# Altium schematic sheet Connectors.SchDoc
size A4; Organization: Rotronic AG; Address1: Grindelstrasse 6; Address2: 8303 Bassersdorf; Address3: Switzerland; SheetNumber: 1; SheetTotal: 1; Web_Address: www.rotronic.ch; E_Mail_Address: *@rotronic.ch; Fon: +41 (0)44 838 11 11; Fax: +41 (0)44 836 44 24
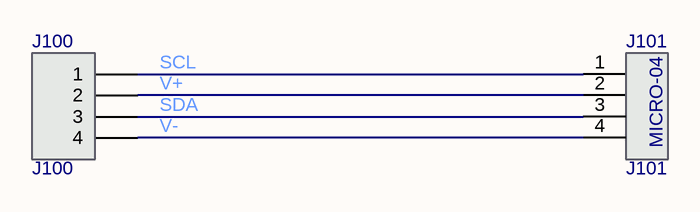
[diagram p0: Connectors.SchDoc]

## Parts
J100  J100  [RRC-MC11-90-2]
J101  J101  [MICRO-04 RIGHT]

## Nets
SCL: J100.1 J101.1
SDA: J100.3 J101.3
V+: J100.2 J101.2
V-: J100.4 J101.4

## Notes on the sheet
- Revision
- Designer
- Datum
- AD-Version
- elektronisch signiert
- Sheet
- of

## Library data of the parts
J100 = N0182: Connector; Part-Number: 00.0000.0000; MF: RRC Power Solutions; Value: RRC-MC11-90-2; ID: N0182; Operating Range: -40°C to +105°C; Note: RRC Battery Contacts; Specification: 02.06.2023 DUJ; Package: None; Price: 3.18; SnapEDA_Link: https://www.snapeda.com/parts/RRC-MC11-90-2/RRC/view-part/?ref=snap; MP: RRC-MC11-90-2; Availability: In Stock; Check_prices: https://www.snapeda.com/parts/RRC-MC11-90-2/RRC/view-part/?ref=eda; Component Type: Standard; ComponentLink1Description: Datasheet; ComponentLink1URL: https://www.rrc-ps.com/fileadmin/Dokumente/Data-Sheets/DS_RRC-MC11-90-2.pdf; Status: Active; Availability Date: 02.06.2023 DUJ; RoHS compliant: Yes; Flammability: UL 94 V-0; Designator: RRC-MC11-90-2; Pin Count: 4; Price 100: 2.89; Price 1000: 2.89; Price Date: 02.06.2023 DUJ; Changed: 02.06.2023 DUJ; Supplier: Mouser; Supplier Part Number 1: 328-RRC-MC11-90-2; Manufacturer: RRC Power Solutions; Manufacturer Part Number: RRC-MC11-90-2; Part Status: Active; RoHS: RoHS Compliant
J101 = N0183: Connector; Part-Number: 00.0000.0000; Manufacturer: Molex; Manufacturer Part Number: 53261-0471; Designator: MICRO-04 RIGHT-ANGLE; ID: N0183; Operating Range: -40°C to +105°C; Note: Headers & Wire Housings 1.25MM HDR 4 CKT Right-Angle; Specification: 02.06.2023 DUJ; Value: MICRO-04 RIGHT-ANGLE; Component Type: Standard; Status: Active; Availability Date: 02.06.2023 DUJ; RoHS compliant: Yes; Flammability: UL 94 V-0; ComponentLink2Description: Drawing; ComponentLink2URL: https://www.molex.com/content/dam/molex/molex-dot-com/products/automated/en-us/salesdrawingpdf/532/53261/532610471_sd.pdf?inline; Pin Count: 4; Price 100: 0.502; Price 1000: 0.357; Price Date: 02.06.2023 DUJ; Changed: 02.06.2023 DUJ; Price: 0.726; Supplier: Mouser; Supplier Part Number 1: 538-53261-0471; Part Status: Active; RoHS: RoHS Compliant